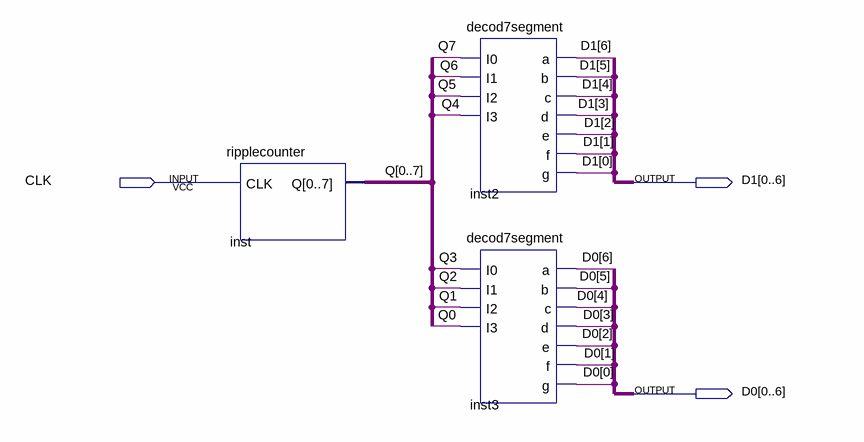
[diagram p0: schematic sheet]
// Quartus schematic ripplecounterdecod7segment.bdf as structural Verilog: 3 symbols, 3 pins
module ripplecounterdecod7segment (
  input  CLK,
  output [0:6] D1,
  output [0:6] D0
);

  wire [7:0] Q;

  ripplecounter inst (.CLK(CLK), .Q({Q[0], Q[1], Q[2], Q[3], Q[4], Q[5], Q[6], Q[7]}));
  decod7segment inst2 (
    .I0(Q[7]), .I1(Q[6]), .I2(Q[5]), .I3(Q[4]), .a(D1[6]), .b(D1[5]), .c(D1[4]), .d(D1[3]), .e(D1[2]),
    .f(D1[1]), .g(D1[0]));
  decod7segment inst3 (
    .I0(Q[3]), .I1(Q[2]), .I2(Q[1]), .I3(Q[0]), .a(D0[6]), .b(D0[5]), .c(D0[4]), .d(D0[3]), .e(D0[2]),
    .f(D0[1]), .g(D0[0]));
endmodule
